# EAGLE design Generic_Proto_Cape_A1 (EAGLE 6.5.0)
AUTHOR: HIEU DUONG; CCO: WWW.CIRCUITCO.COM; DN: 999-0004261; REV: A1; TITLE: GENERIC PROTO CAPE
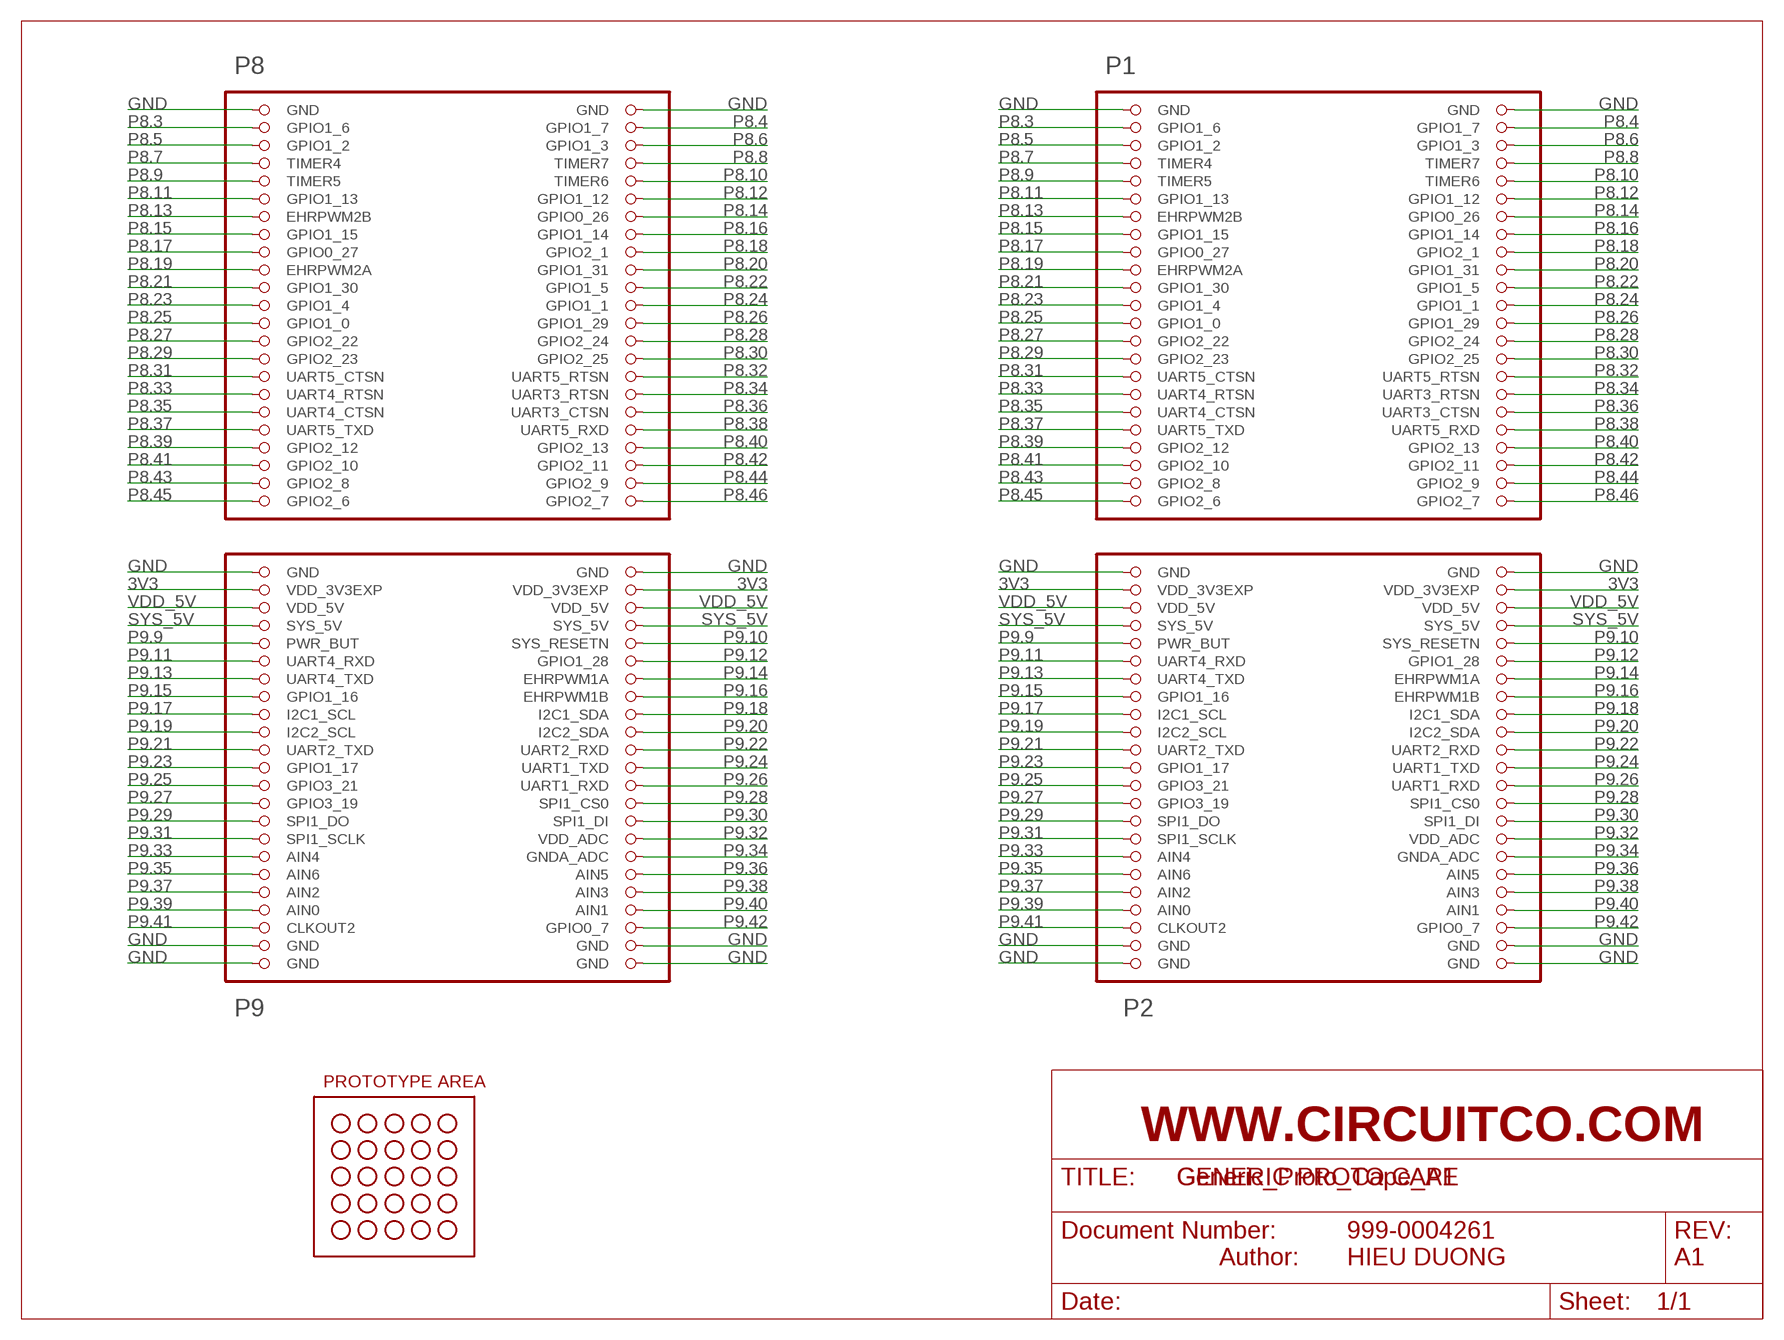
[diagram p0: schematic, sheet 1]

## Parts
U1  BB_OL_GENPROTO  [BB_OL_GENPROTO]
U2  PROTO_CAPE_GEN  [PROTO_CAPE_GEN]
U$2  PROTOTYPE_AREA_GEN  [PROTOTYPE_AREA_GEN]

## Nets
3V3: U1.49(VDD_3V3EXP) U1.50(VDD_3V3EXP) U2.49(VDD_3V3EXP) U2.50(VDD_3V3EXP)
GND: U1.1(GND) U1.2(GND) U1.47(GND) U1.48(GND) U1.89(GND) U1.90(GND) U1.91(GND) U1.92(GND) U2.1(GND) U2.2(GND) U2.47(GND) U2.48(GND) U2.89(GND) U2.90(GND) U2.91(GND) U2.92(GND)
P8.3: U1.3(GPIO1_6) U2.3(GPIO1_6)
P8.4: U1.4(GPIO1_7) U2.4(GPIO1_7)
P8.5: U1.5(GPIO1_2) U2.5(GPIO1_2)
P8.6: U1.6(GPIO1_3) U2.6(GPIO1_3)
P8.7: U1.7(TIMER4) U2.7(TIMER4)
P8.8: U1.8(TIMER7) U2.8(TIMER7)
P8.9: U1.9(TIMER5) U2.9(TIMER5)
P8.10: U1.10(TIMER6) U2.10(TIMER6)
P8.11: U1.11(GPIO1_13) U2.11(GPIO1_13)
P8.12: U1.12(GPIO1_12) U2.12(GPIO1_12)
P8.13: U1.13(EHRPWM2B) U2.13(EHRPWM2B)
P8.14: U1.14(GPIO0_26) U2.14(GPIO0_26)
P8.15: U1.15(GPIO1_15) U2.15(GPIO1_15)
P8.16: U1.16(GPIO1_14) U2.16(GPIO1_14)
P8.17: U1.17(GPIO0_27) U2.17(GPIO0_27)
P8.18: U1.18(GPIO2_1) U2.18(GPIO2_1)
P8.19: U1.19(EHRPWM2A) U2.19(EHRPWM2A)
P8.20: U1.20(GPIO1_31) U2.20(GPIO1_31)
P8.21: U1.21(GPIO1_30) U2.21(GPIO1_30)
P8.22: U1.22(GPIO1_5) U2.22(GPIO1_5)
P8.23: U1.23(GPIO1_4) U2.23(GPIO1_4)
P8.24: U1.24(GPIO1_1) U2.24(GPIO1_1)
P8.25: U1.25(GPIO1_0) U2.25(GPIO1_0)
P8.26: U1.26(GPIO1_29) U2.26(GPIO1_29)
P8.27: U1.27(GPIO2_22) U2.27(GPIO2_22)
P8.28: U1.28(GPIO2_24) U2.28(GPIO2_24)
P8.29: U1.29(GPIO2_23) U2.29(GPIO2_23)
P8.30: U1.30(GPIO2_25) U2.30(GPIO2_25)
P8.31: U1.31(UART5_CTSN) U2.31(UART5_CTSN)
P8.32: U1.32(UART5_RTSN) U2.32(UART5_RTSN)
P8.33: U1.33(UART4_RTSN) U2.33(UART4_RTSN)
P8.34: U1.34(UART3_RTSN) U2.34(UART3_RTSN)
P8.35: U1.35(UART4_CTSN) U2.35(UART4_CTSN)
P8.36: U1.36(UART3_CTSN) U2.36(UART3_CTSN)
P8.37: U1.37(UART5_TXD) U2.37(UART5_TXD)
P8.38: U1.38(UART5_RXD) U2.38(UART5_RXD)
P8.39: U1.39(GPIO2_12) U2.39(GPIO2_12)
P8.40: U1.40(GPIO2_13) U2.40(GPIO2_13)
P8.41: U1.41(GPIO2_10) U2.41(GPIO2_10)
P8.42: U1.42(GPIO2_11) U2.42(GPIO2_11)
P8.43: U1.43(GPIO2_8) U2.43(GPIO2_8)
P8.44: U1.44(GPIO2_9) U2.44(GPIO2_9)
P8.45: U1.45(GPIO2_6) U2.45(GPIO2_6)
P8.46: U1.46(GPIO2_7) U2.46(GPIO2_7)
P9.9: U1.55(PWR_BUT) U2.55(PWR_BUT)
P9.10: U1.56(SYS_RESETN) U2.56(SYS_RESETN)
P9.11: U1.57(UART4_RXD) U2.57(UART4_RXD)
P9.12: U1.58(GPIO1_28) U2.58(GPIO1_28)
P9.13: U1.59(UART4_TXD) U2.59(UART4_TXD)
P9.14: U1.60(EHRPWM1A) U2.60(EHRPWM1A)
P9.15: U1.61(GPIO1_16) U2.61(GPIO1_16)
P9.16: U1.62(EHRPWM1B) U2.62(EHRPWM1B)
P9.17: U1.63(I2C1_SCL) U2.63(I2C1_SCL)
P9.18: U1.64(I2C1_SDA) U2.64(I2C1_SDA)
P9.19: U1.65(I2C2_SCL) U2.65(I2C2_SCL)
P9.20: U1.66(I2C2_SDA) U2.66(I2C2_SDA)
P9.21: U1.67(UART2_TXD) U2.67(UART2_TXD)
P9.22: U1.68(UART2_RXD) U2.68(UART2_RXD)
P9.23: U1.69(GPIO1_17) U2.69(GPIO1_17)
P9.24: U1.70(UART1_TXD) U2.70(UART1_TXD)
P9.25: U1.71(GPIO3_21) U2.71(GPIO3_21)
P9.26: U1.72(UART1_RXD) U2.72(UART1_RXD)
P9.27: U1.73(GPIO3_19) U2.73(GPIO3_19)
P9.28: U1.74(SPI1_CS0) U2.74(SPI1_CS0)
P9.29: U1.75(SPI1_DO) U2.75(SPI1_DO)
P9.30: U1.76(SPI1_DI) U2.76(SPI1_DI)
P9.31: U1.77(SPI1_SCLK) U2.77(SPI1_SCLK)
P9.32: U1.78(VDD_ADC) U2.78(VDD_ADC)
P9.33: U1.79(AIN4) U2.79(AIN4)
P9.34: U1.80(GNDA_ADC) U2.80(GNDA_ADC)
P9.35: U1.81(AIN6) U2.81(AIN6)
P9.36: U1.82(AIN5) U2.82(AIN5)
P9.37: U1.83(AIN2) U2.83(AIN2)
P9.38: U1.84(AIN3) U2.84(AIN3)
P9.39: U1.85(AIN0) U2.85(AIN0)
P9.40: U1.86(AIN1) U2.86(AIN1)
P9.41: U1.87(CLKOUT2) U2.87(CLKOUT2)
P9.42: U1.88(GPIO0_7) U2.88(GPIO0_7)
SYS_5V: U1.53(SYS_5V) U1.54(SYS_5V) U2.53(SYS_5V) U2.54(SYS_5V)
VDD_5V: U1.51(VDD_5V) U1.52(VDD_5V) U2.51(VDD_5V) U2.52(VDD_5V)

## Notes on the sheet
- P8 | P1
- P9 | P2
- PROTOTYPE AREA
- Author:

## Library data of the parts
U1 = circuitco-eagle:BB_OL_GENPROTO
U2 = circuitco-eagle:PROTO_CAPE_GEN
U$2 = circuitco-eagle:PROTOTYPE_AREA_GEN

## Board
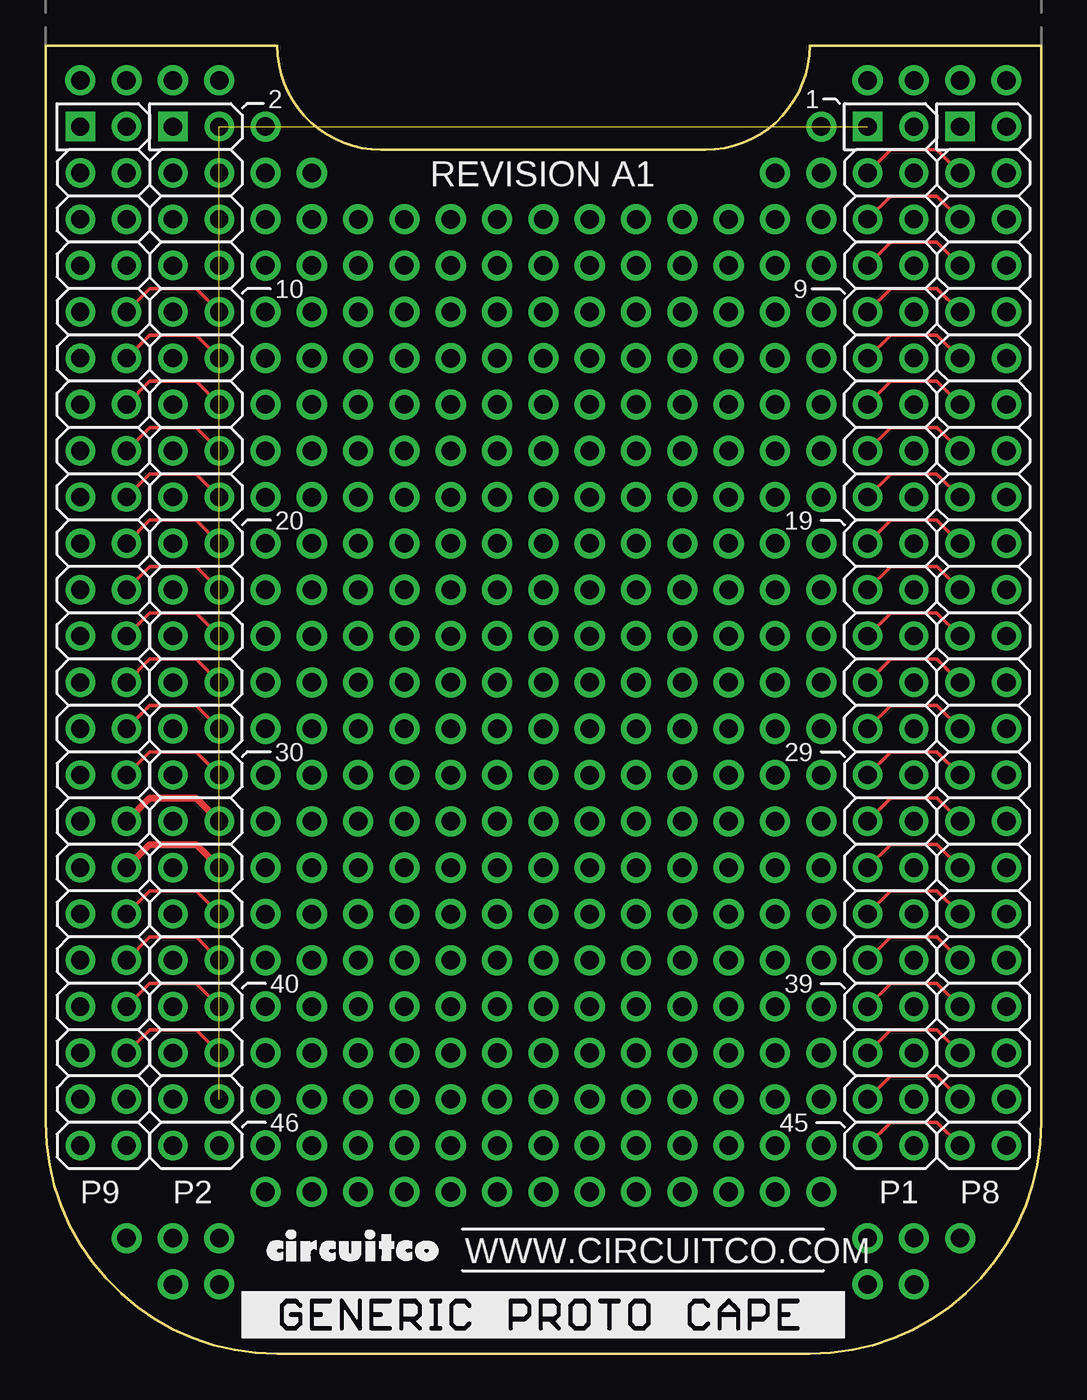
[diagram p1: board, top side]
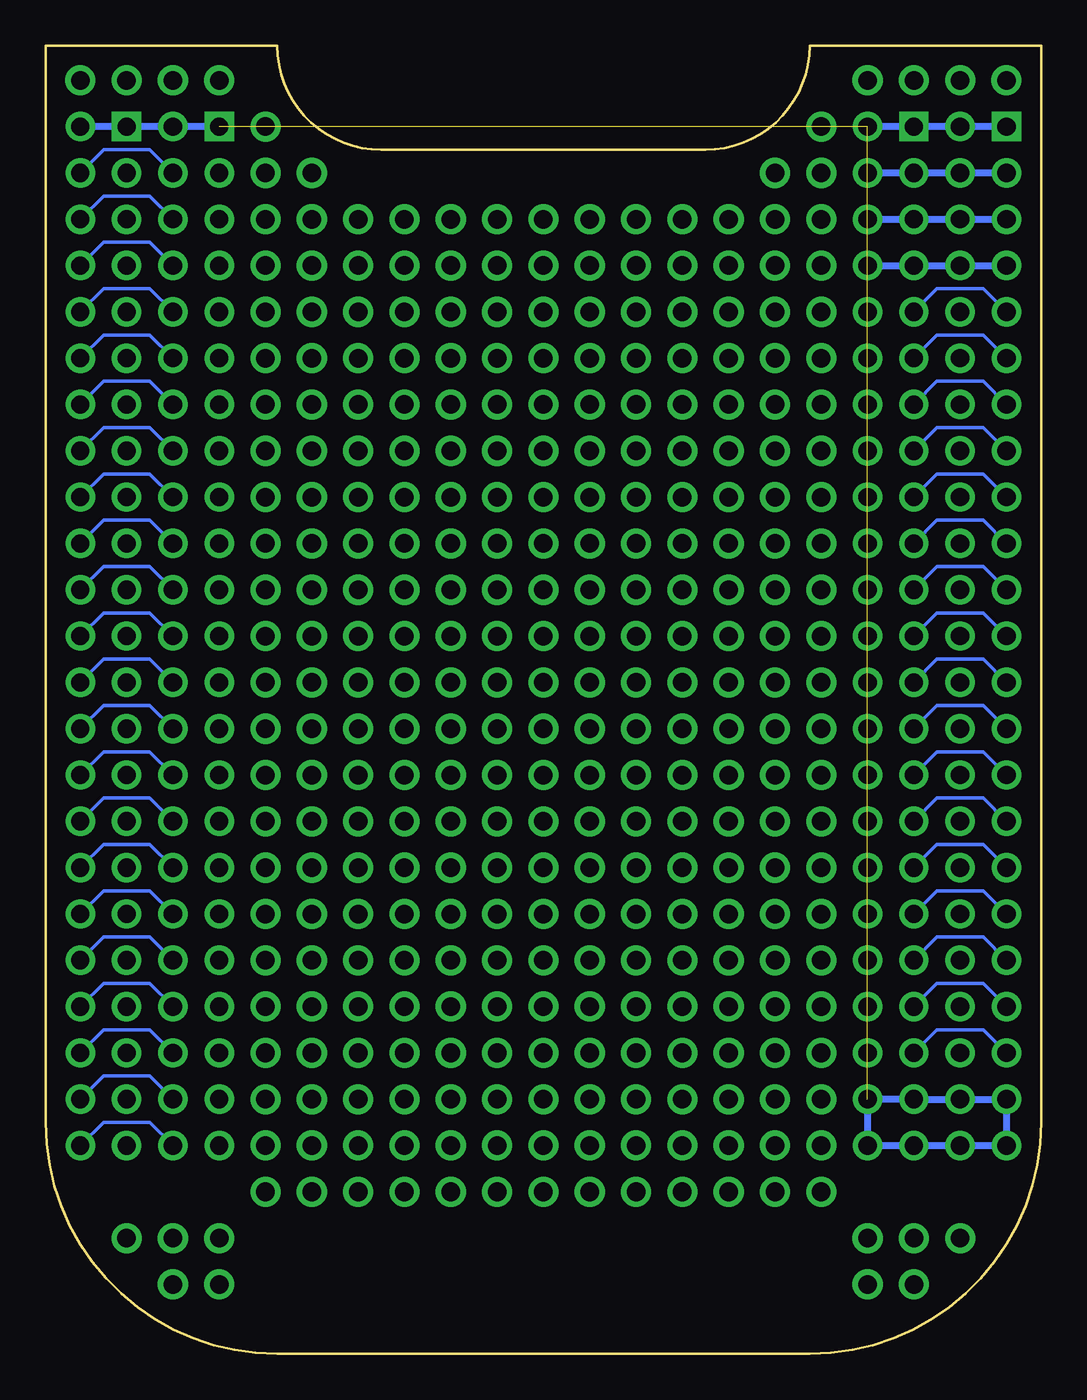
[diagram p2: board, bottom side, seen from below]

Size 54.61 x 71.75 mm. Coordinates in mm from the lower left corner, seen from the top.
Copper layers (1*16): Top 0.035mm / dielectric 1.5mm / Bottom 0.035mm
Design rules "CircuitCo-HD": minimum track width 8mil, minimum drill 15mil, track to track 8mil, track to pad 8mil, pad to pad 3mil, via to via 8mil, smd to smd 0mil, copper to edge 12mil, drill to drill 8mil, minimum pad ring 12mil, minimum via ring 10mil, stop-mask expansion 4mil, vias tented up to drill 25mil, thermal gap 10mil

### Footprints (pad centres in the part's own frame; a part is rotated, then mirrored left to right if it is on the bottom)
BB_OL_GENPROTO = drill 1 square: 1 50.165,67.31; 47 1.905,67.31 | drill 1: 2 52.705,67.31; 3 50.165,64.77; 4 52.705,64.77; 5 50.165,62.23; 6 52.705,62.23; 7 50.165,59.69; 8 52.705,59.69; 9 50.165,57.15; 10 52.705,57.15; 11 50.165,54.61; 12 52.705,54.61; 13 50.165,52.07; 14 52.705,52.07; 15 50.165,49.53; 16 52.705,49.53; 17 50.165,46.99; 18 52.705,46.99; 19 50.165,44.45; 20 52.705,44.45; 21 50.165,41.91; 22 52.705,41.91; 23 50.165,39.37; 24 52.705,39.37; 25 50.165,36.83; 26 52.705,36.83; 27 50.165,34.29; 28 52.705,34.29; 29 50.165,31.75; 30 52.705,31.75; 31 50.165,29.21; 32 52.705,29.21; 33 50.165,26.67; 34 52.705,26.67; 35 50.165,24.13; 36 52.705,24.13; 37 50.165,21.59; 38 52.705,21.59; 39 50.165,19.05; 40 52.705,19.05; 41 50.165,16.51; 42 52.705,16.51; 43 50.165,13.97; 44 52.705,13.97; 45 50.165,11.43; 46 52.705,11.43; 48 4.445,67.31; 49 1.905,64.77; 50 4.445,64.77; 51 1.905,62.23; 52 4.445,62.23; 53 1.905,59.69; 54 4.445,59.69; 55 1.905,57.15; 56 4.445,57.15; 57 1.905,54.61; 58 4.445,54.61; 59 1.905,52.07; 60 4.445,52.07; 61 1.905,49.53; 62 4.445,49.53; 63 1.905,46.99; 64 4.445,46.99; 65 1.905,44.45; 66 4.445,44.45; 67 1.905,41.91; 68 4.445,41.91; 69 1.905,39.37; 70 4.445,39.37; 71 1.905,36.83; 72 4.445,36.83; 73 1.905,34.29; 74 4.445,34.29; 75 1.905,31.75; 76 4.445,31.75; 77 1.905,29.21; 78 4.445,29.21; 79 1.905,26.67; 80 4.445,26.67; 81 1.905,24.13; 82 4.445,24.13; 83 1.905,21.59; 84 4.445,21.59; 85 1.905,19.05; 86 4.445,19.05; 87 1.905,16.51; 88 4.445,16.51; 89 1.905,13.97; 90 4.445,13.97; 91 1.905,11.43; 92 4.445,11.43
PROTO_CAPE_GEN = drill 1 square: 1 45.085,67.31; 47 6.985,67.31 | drill 1: 2 47.625,67.31; 3 45.085,64.77; 4 47.625,64.77; 5 45.085,62.23; 6 47.625,62.23; 7 45.085,59.69; 8 47.625,59.69; 9 45.085,57.15; 10 47.625,57.15; 11 45.085,54.61; 12 47.625,54.61; 13 45.085,52.07; 14 47.625,52.07; 15 45.085,49.53; 16 47.625,49.53; 17 45.085,46.99; 18 47.625,46.99; 19 45.085,44.45; 20 47.625,44.45; 21 45.085,41.91; 22 47.625,41.91; 23 45.085,39.37; 24 47.625,39.37; 25 45.085,36.83; 26 47.625,36.83; 27 45.085,34.29; 28 47.625,34.29; 29 45.085,31.75; 30 47.625,31.75; 31 45.085,29.21; 32 47.625,29.21; 33 45.085,26.67; 34 47.625,26.67; 35 45.085,24.13; 36 47.625,24.13; 37 45.085,21.59; 38 47.625,21.59; 39 45.085,19.05; 40 47.625,19.05; 41 45.085,16.51; 42 47.625,16.51; 43 45.085,13.97; 44 47.625,13.97; 45 45.085,11.43; 46 47.625,11.43; 48 9.525,67.31; 49 6.985,64.77; 50 9.525,64.77; 51 6.985,62.23; 52 9.525,62.23; 53 6.985,59.69; 54 9.525,59.69; 55 6.985,57.15; 56 9.525,57.15; 57 6.985,54.61; 58 9.525,54.61; 59 6.985,52.07; 60 9.525,52.07; 61 6.985,49.53; 62 9.525,49.53; 63 6.985,46.99; 64 9.525,46.99; 65 6.985,44.45; 66 9.525,44.45; 67 6.985,41.91; 68 9.525,41.91; 69 6.985,39.37; 70 9.525,39.37; 71 6.985,36.83; 72 9.525,36.83; 73 6.985,34.29; 74 9.525,34.29; 75 6.985,31.75; 76 9.525,31.75; 77 6.985,29.21; 78 9.525,29.21; 79 6.985,26.67; 80 9.525,26.67; 81 6.985,24.13; 82 9.525,24.13; 83 6.985,21.59; 84 9.525,21.59; 85 6.985,19.05; 86 9.525,19.05; 87 6.985,16.51; 88 9.525,16.51; 89 6.985,13.97; 90 9.525,13.97; 91 6.985,11.43; 92 9.525,11.43
PROTOTYPE_AREA_GEN = drill 1.016 pad 1.651: P$25 31.75,64.77; P$26 31.75,62.23; P$27 31.75,59.69; P$28 31.75,57.15; P$29 31.75,54.61; P$30 31.75,52.07; P$31 31.75,49.53; P$32 31.75,46.99; P$33 31.75,44.45; P$34 26.67,67.31; P$35 29.21,67.31; P$36 24.13,67.31; P$37 21.59,67.31; P$38 31.75,41.91; P$39 31.75,39.37; P$40 31.75,36.83; P$41 31.75,34.29; P$42 31.75,31.75; P$43 31.75,29.21; P$44 31.75,26.67; P$45 31.75,24.13; P$46 31.75,21.59; P$47 31.75,19.05; P$48 31.75,16.51; P$49 31.75,13.97; P$50 31.75,11.43; P$51 31.75,8.89; P$52 31.75,6.35; P$53 24.13,3.81; P$64 26.67,3.81; P$65 26.67,1.27; P$75 29.21,3.81; P$76 29.21,1.27; P$78 64.77,3.81; P$79 64.77,1.27; P$81 67.31,3.81; P$82 67.31,1.27; P$83 34.29,62.23; P$84 34.29,59.69; P$85 34.29,57.15; P$86 34.29,54.61; P$87 34.29,52.07; P$88 34.29,49.53; P$89 34.29,46.99; P$90 34.29,44.45; P$91 34.29,41.91; P$92 34.29,39.37; P$93 34.29,36.83; P$94 34.29,34.29; P$95 34.29,31.75; P$96 34.29,29.21; P$97 34.29,26.67; P$98 34.29,24.13; P$99 34.29,21.59; P$100 34.29,19.05; P$101 34.29,16.51; P$102 34.29,13.97; P$103 34.29,11.43; P$104 34.29,8.89; P$105 34.29,6.35; P$106 69.85,3.81; P$108 36.83,59.69; P$109 36.83,57.15; P$110 36.83,54.61; P$111 36.83,52.07; P$112 36.83,49.53; P$113 36.83,46.99; P$114 36.83,44.45; P$115 36.83,41.91; P$116 36.83,39.37; P$117 36.83,36.83; P$118 36.83,34.29; P$119 36.83,31.75; P$120 36.83,29.21; P$121 36.83,26.67; P$122 36.83,24.13; P$123 36.83,21.59; P$124 36.83,19.05; P$125 36.83,16.51; P$126 36.83,13.97; P$127 36.83,11.43; P$128 36.83,8.89; P$129 36.83,6.35; P$132 39.37,59.69; P$133 39.37,57.15; P$134 39.37,54.61; P$135 39.37,52.07; P$136 39.37,49.53; P$137 39.37,46.99; P$138 39.37,44.45; P$139 39.37,41.91; P$140 39.37,39.37; P$141 39.37,36.83; P$142 39.37,34.29; P$143 39.37,31.75; P$144 39.37,29.21; P$145 39.37,26.67; P$146 39.37,24.13; P$147 39.37,21.59; P$148 39.37,19.05; P$149 39.37,16.51; P$150 39.37,13.97; P$151 39.37,11.43; P$152 39.37,8.89; P$153 39.37,6.35; P$156 41.91,59.69; P$157 41.91,57.15; P$158 41.91,54.61; P$159 41.91,52.07; P$160 41.91,49.53; P$161 41.91,46.99; P$162 41.91,44.45; P$163 41.91,41.91; P$164 41.91,39.37; P$165 41.91,36.83; P$166 41.91,34.29; P$167 41.91,31.75; P$168 41.91,29.21; P$169 44.45,46.99; P$170 44.45,44.45; P$171 41.91,21.59; P$172 41.91,19.05; P$173 41.91,16.51; P$174 41.91,13.97; P$175 41.91,11.43; P$176 41.91,8.89; P$177 41.91,6.35; P$180 44.45,59.69; P$181 44.45,57.15; P$182 44.45,54.61; P$183 44.45,52.07; P$184 44.45,49.53; P$185 44.45,41.91; P$186 44.45,39.37; P$187 44.45,36.83; P$188 44.45,34.29; P$189 44.45,31.75; P$190 44.45,29.21; P$191 46.99,46.99; P$192 46.99,44.45; P$193 46.99,41.91; P$194 46.99,39.37; P$195 44.45,21.59; P$196 44.45,19.05; P$197 44.45,16.51; P$198 44.45,13.97; P$199 44.45,11.43; P$200 44.45,8.89; P$201 44.45,6.35; P$204 46.99,59.69; P$205 46.99,57.15; P$206 46.99,54.61; P$207 46.99,52.07; P$208 46.99,49.53; P$209 46.99,36.83; P$210 46.99,34.29; P$211 46.99,31.75; P$212 46.99,29.21; P$213 49.53,46.99; P$214 49.53,44.45; P$215 49.53,41.91; P$216 49.53,39.37; P$217 49.53,36.83; P$218 49.53,34.29; P$219 46.99,21.59; P$220 46.99,19.05; P$221 46.99,16.51; P$222 46.99,13.97; P$223 46.99,11.43; P$224 46.99,8.89; P$225 46.99,6.35; P$228 49.53,59.69; P$229 49.53,57.15; P$230 49.53,54.61; P$231 49.53,52.07; P$232 49.53,49.53; P$233 49.53,31.75; P$234 49.53,29.21; P$235 52.07,46.99; P$236 52.07,44.45; P$237 52.07,41.91; P$238 52.07,39.37; P$239 52.07,36.83; P$240 52.07,34.29; P$241 52.07,31.75; P$242 52.07,29.21; P$243 49.53,21.59; P$244 49.53,19.05; P$245 49.53,16.51; P$246 49.53,13.97; P$247 49.53,11.43; P$248 49.53,8.89; P$249 49.53,6.35; P$252 52.07,59.69; P$253 52.07,57.15; P$254 52.07,54.61; P$255 52.07,52.07; P$256 52.07,49.53; P$257 52.07,26.67; P$258 52.07,24.13; P$259 41.91,26.67; P$260 41.91,24.13; P$261 44.45,26.67; P$262 44.45,24.13; P$263 46.99,26.67; P$264 46.99,24.13; P$265 49.53,26.67; P$266 49.53,24.13; P$267 52.07,21.59; P$268 52.07,19.05; P$269 52.07,16.51; P$270 52.07,13.97; P$271 52.07,11.43; P$272 52.07,8.89; P$273 52.07,6.35; P$276 54.61,59.69; P$277 54.61,57.15; P$278 54.61,54.61; P$279 54.61,52.07; P$280 54.61,49.53; P$281 54.61,46.99; P$282 54.61,44.45; P$283 54.61,41.91; P$284 54.61,39.37; P$285 54.61,36.83; P$286 54.61,34.29; P$287 54.61,31.75; P$288 54.61,29.21; P$289 54.61,26.67; P$290 54.61,24.13; P$291 54.61,21.59; P$292 54.61,19.05; P$293 54.61,16.51; P$294 54.61,13.97; P$295 54.61,11.43; P$296 54.61,8.89; P$297 54.61,6.35; P$300 57.15,59.69; P$301 57.15,57.15; P$302 57.15,54.61; P$303 57.15,52.07; P$304 57.15,49.53; P$305 57.15,46.99; P$306 57.15,44.45; P$307 57.15,41.91; P$308 57.15,39.37; P$309 57.15,36.83; P$310 57.15,34.29; P$311 57.15,31.75; P$312 57.15,29.21; P$313 57.15,26.67; P$314 57.15,24.13; P$315 57.15,21.59; P$316 57.15,19.05; P$317 57.15,16.51; P$318 57.15,13.97; P$319 57.15,11.43; P$320 57.15,8.89; P$321 57.15,6.35; P$324 59.69,59.69; P$325 59.69,57.15; P$326 59.69,54.61; P$327 59.69,52.07; P$328 59.69,49.53; P$329 59.69,46.99; P$330 59.69,44.45; P$331 59.69,41.91; P$332 59.69,39.37; P$333 59.69,36.83; P$334 59.69,34.29; P$335 59.69,31.75; P$336 59.69,29.21; P$337 59.69,26.67; P$338 59.69,24.13; P$339 59.69,21.59; P$340 59.69,19.05; P$341 59.69,16.51; P$342 59.69,13.97; P$343 59.69,11.43; P$344 59.69,8.89; P$345 59.69,6.35; P$348 62.23,59.69; P$349 62.23,57.15; P$350 62.23,54.61; P$351 62.23,52.07; P$352 62.23,49.53; P$353 62.23,46.99; P$354 62.23,44.45; P$355 62.23,41.91; P$356 62.23,39.37; P$357 62.23,36.83; P$358 62.23,34.29; P$359 62.23,31.75; P$360 62.23,29.21; P$361 62.23,26.67; P$362 62.23,24.13; P$363 62.23,21.59; P$364 62.23,19.05; P$365 62.23,16.51; P$366 62.23,13.97; P$367 62.23,11.43; P$368 62.23,8.89; P$369 62.23,6.35; P$420 59.69,62.23; P$421 62.23,62.23; P$424 62.23,64.77; P$427 64.77,67.31; P$428 67.31,67.31; P$487 69.85,67.31; P$488 72.39,67.31

### Placement (x,y rotation side)
DRILEGEND  [DRILEGEND]  12.32,-21.07 0 top  (outside the outline)
U1  0,0 0 top
U2  0,0 0 top
U$1  [CIRCUITCO-LOGO]  12.06,4.95 0 top
U$2  -19.68,2.54 0 top
U$3  [NEGA-GENPROTOCAPE]  9.53,-0.64 0 top

### Tracks (layer width: path | path; a pad name or v marks a point on that pad's centre or on a via)
3V3
  Bottom 0.381: U1.49 U1.50 U2.49 U2.50
GND  (2 unrouted)
  Bottom 0.381: U1.47 U1.48 U2.47 U2.48 | U2.1 U2.2 U1.1 U1.2 | U2.89 U2.90 U2.92 U2.91 U1.92 U1.91 U1.89 U1.90 U2.89
P8.3
  Top 0.203: U2.3 46.35,66.04 48.9,66.04 U1.3
P8.4
  Bottom 0.203: U1.4 51.44,66.04 48.9,66.04 U2.4
P8.5
  Top 0.203: U2.5 46.35,63.5 48.9,63.5 U1.5
P8.6
  Bottom 0.203: U1.6 51.44,63.5 48.9,63.5 U2.6
P8.7
  Top 0.203: U2.7 46.35,60.96 48.9,60.96 U1.7
P8.8
  Bottom 0.203: U1.8 51.44,60.96 48.9,60.96 U2.8
P8.9
  Top 0.203: U2.9 46.35,58.42 48.9,58.42 U1.9
P8.10
  Bottom 0.203: U1.10 51.44,58.42 48.9,58.42 U2.10
P8.11
  Top 0.203: U2.11 46.35,55.88 48.9,55.88 U1.11
P8.12
  Bottom 0.203: U1.12 51.44,55.88 48.9,55.88 U2.12
P8.13
  Top 0.203: U2.13 46.35,53.34 48.9,53.34 U1.13
P8.14
  Bottom 0.203: U1.14 51.44,53.34 48.9,53.34 U2.14
P8.15
  Top 0.203: U2.15 46.35,50.8 48.9,50.8 U1.15
P8.16
  Bottom 0.203: U1.16 51.44,50.8 48.9,50.8 U2.16
P8.17
  Top 0.203: U2.17 46.35,48.26 48.9,48.26 U1.17
P8.18
  Bottom 0.203: U1.18 51.44,48.26 48.9,48.26 U2.18
P8.19
  Top 0.203: U2.19 46.35,45.72 48.9,45.72 U1.19
P8.20
  Bottom 0.203: U1.20 51.44,45.72 48.9,45.72 U2.20
P8.21
  Top 0.203: U2.21 46.35,43.18 48.9,43.18 U1.21
P8.22
  Bottom 0.203: U1.22 51.44,43.18 48.9,43.18 U2.22
P8.23
  Top 0.203: U2.23 46.35,40.64 48.9,40.64 U1.23
P8.24
  Bottom 0.203: U1.24 51.44,40.64 48.9,40.64 U2.24
P8.25
  Top 0.203: U2.25 46.35,38.1 48.9,38.1 U1.25
P8.26
  Bottom 0.203: U1.26 51.44,38.1 48.9,38.1 U2.26
P8.27
  Top 0.203: U2.27 46.35,35.56 48.9,35.56 U1.27
P8.28
  Bottom 0.203: U1.28 51.44,35.56 48.9,35.56 U2.28
P8.29
  Top 0.203: U2.29 46.35,33.02 48.9,33.02 U1.29
P8.30
  Bottom 0.203: U1.30 51.44,33.02 48.9,33.02 U2.30
P8.31
  Top 0.203: U2.31 46.35,30.48 48.9,30.48 U1.31
P8.32
  Bottom 0.203: U1.32 51.44,30.48 48.9,30.48 U2.32
P8.33
  Top 0.203: U2.33 46.35,27.94 48.9,27.94 U1.33
P8.34
  Bottom 0.203: U1.34 51.44,27.94 48.9,27.94 U2.34
P8.35
  Top 0.203: U2.35 46.35,25.4 48.9,25.4 U1.35
P8.36
  Bottom 0.203: U1.36 51.44,25.4 48.9,25.4 U2.36
P8.37
  Top 0.203: U2.37 46.35,22.86 48.9,22.86 U1.37
P8.38
  Bottom 0.203: U1.38 51.44,22.86 48.9,22.86 U2.38
P8.39
  Top 0.203: U2.39 46.35,20.32 48.9,20.32 U1.39
P8.40
  Bottom 0.203: U1.40 51.44,20.32 48.9,20.32 U2.40
P8.41
  Top 0.203: U2.41 46.35,17.78 48.9,17.78 U1.41
P8.42
  Bottom 0.203: U1.42 51.44,17.78 48.9,17.78 U2.42
P8.43
  Top 0.203: U2.43 46.35,15.24 48.9,15.24 U1.43
P8.44
  Bottom 0.203: U1.44 51.44,15.24 48.9,15.24 U2.44
P8.45
  Top 0.203: U2.45 46.35,12.7 48.9,12.7 U1.45
P8.46
  Bottom 0.203: U1.46 51.44,12.7 48.9,12.7 U2.46
P9.9
  Bottom 0.203: U1.55 3.17,58.42 5.71,58.42 U2.55
P9.10
  Top 0.203: U1.56 5.71,58.42 8.26,58.42 U2.56
P9.11
  Bottom 0.203: U1.57 3.17,55.88 5.71,55.88 U2.57
P9.12
  Top 0.203: U1.58 5.71,55.88 8.26,55.88 U2.58
P9.13
  Bottom 0.203: U1.59 3.17,53.34 5.71,53.34 U2.59
P9.14
  Top 0.203: U1.60 5.71,53.34 8.26,53.34 U2.60
P9.15
  Bottom 0.203: U1.61 3.17,50.8 5.71,50.8 U2.61
P9.16
  Top 0.203: U1.62 5.71,50.8 8.26,50.8 U2.62
P9.17
  Bottom 0.203: U1.63 3.17,48.26 5.71,48.26 U2.63
P9.18
  Top 0.203: U1.64 5.71,48.26 8.26,48.26 U2.64
P9.19
  Bottom 0.203: U1.65 3.17,45.72 5.71,45.72 U2.65
P9.20
  Top 0.203: U1.66 5.71,45.72 8.26,45.72 U2.66
P9.21
  Bottom 0.203: U1.67 3.17,43.18 5.71,43.18 U2.67
P9.22
  Top 0.203: U1.68 5.71,43.18 8.26,43.18 U2.68
P9.23
  Bottom 0.203: U1.69 3.17,40.64 5.71,40.64 U2.69
P9.24
  Top 0.203: U1.70 5.71,40.64 8.26,40.64 U2.70
P9.25
  Bottom 0.203: U1.71 3.17,38.1 5.71,38.1 U2.71
P9.26
  Top 0.203: U1.72 5.71,38.1 8.26,38.1 U2.72
P9.27
  Bottom 0.203: U1.73 3.17,35.56 5.71,35.56 U2.73
P9.28
  Top 0.203: U1.74 5.71,35.56 8.26,35.56 U2.74
P9.29
  Bottom 0.203: U1.75 3.17,33.02 5.71,33.02 U2.75
P9.30
  Top 0.203: U1.76 5.71,33.02 8.26,33.02 U2.76
P9.31
  Bottom 0.203: U1.77 3.17,30.48 5.71,30.48 U2.77
P9.32
  Top 0.381: U1.78 5.71,30.48 8.26,30.48 U2.78
P9.33
  Bottom 0.203: U1.79 3.17,27.94 5.71,27.94 U2.79
P9.34
  Top 0.381: U1.80 5.71,27.94 8.26,27.94 U2.80
P9.35
  Bottom 0.203: U1.81 3.17,25.4 5.71,25.4 U2.81
P9.36
  Top 0.203: U1.82 5.71,25.4 8.26,25.4 U2.82
P9.37
  Bottom 0.203: U1.83 3.17,22.86 5.71,22.86 U2.83
P9.38
  Top 0.203: U1.84 5.71,22.86 8.26,22.86 U2.84
P9.39
  Bottom 0.203: U1.85 3.17,20.32 5.71,20.32 U2.85
P9.40
  Top 0.203: U1.86 5.71,20.32 8.26,20.32 U2.86
P9.41
  Bottom 0.203: U1.87 3.17,17.78 5.71,17.78 U2.87
P9.42
  Top 0.203: U1.88 5.71,17.78 8.26,17.78 U2.88
SYS_5V
  Bottom 0.381: U2.54 U2.53 U1.54 U1.53
VDD_5V
  Bottom 0.381: U2.52 U2.51 U1.52 U1.51

### Text on the board
tPlace: 2 | 1 | REVISION A1 | 10 | 9 | 20 | 19 | 30 | 29 | 40 | 39 | 46 | 45 | P9 | P2 | P1 | P8 | WWW.CIRCUITCO.COM
Document: GENERIC PROTO CAPE REV A1 / ASSEMBLY DRAWING - TOP VIEW
DrillLegend: -ALL DIMENSIONS IN INCHES UNESS | OTHERWISE NOTED | - NO. LAYERS: 4 | - ARRAY: NO | - BOARD SIZE: 2.150000 x 2.825000 In. | - X-OUTS ALLOWED: YES | - SCORING: YES | - JUMP SCORING: NO | - TAB ROUT: NO | - MATERIAL: FR4 | - FINAL THICKNESS: 0.062000 | - PLATING: IMMERSION GOLD | - OUTER CU WEIGHT: 1.000000 | - MASK SIDES: BOTH | - MASK COLOR: WHITE | - SILKSCREEN SIDES: FRONT | - SILKSCREEN COLOR: BLACK | - GOLD FINGERS: NO | - MIN TRACE/SPACE: 8 | - MIN HOLE SIZE: 15 | - NO. HOLES UNDER 12 MIL: 0 | - PLATED SLOTS: NO | - PLATED EDGES: NO | - RoHS COMPLIANT: YES | - ITAR COMPLIANT: NO | - CONFORM TO IPC-A-600, CLASS 2: YES | - CLASS 3: NO | - MILSPEC: NO | - ADD UL LOGO: YES | - ADD DATE CODE: YES | - ADD 94V-0 MARKINGS: YES | - COUNTERSINKS/BORES: NO | - CONTROLLED DIELECTRIC: NO | - CARBON INK: NO | - BLIND/BURRIED VIAS: NO | - VIA IN PAD: NO | - MASK PLUGGED VIAS: NO | - CONDUCTIVE FILLED VIAS: NO | - CONTROLLED IMPEDANCE: NO | LAYER-STACK
DrillLegend_01-16: 01-16